# EAGLE design humidifier (EAGLE 8.6.0)
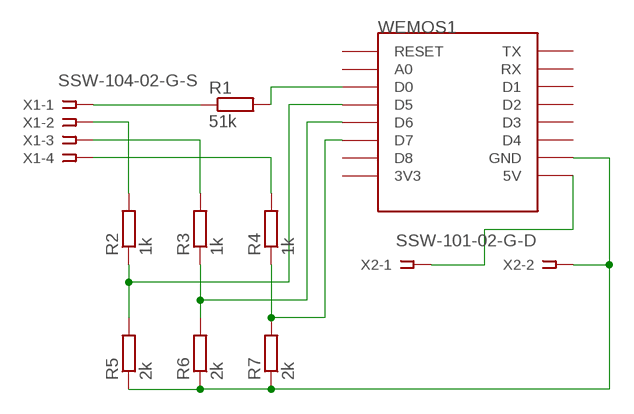
[diagram p0: schematic, sheet 1]

## Parts
R1  51k  R-EU_R1206  [R1206]
R2  1k  R-EU_R1206  [R1206]
R3  1k  R-EU_R1206  [R1206]
R4  1k  R-EU_R1206  [R1206]
R5  2k  R-EU_R1206  [R1206]
R6  2k  R-EU_R1206  [R1206]
R7  2k  R-EU_R1206  [R1206]
WEMOS1  WEMOS-D1-MINI  [WEMOS-D1-MINI]
X1  SSW-104-02-G-S  [SSW-104-02-G-S]
X2  SSW-101-02-G-D  [SSW-101-02-G-D]

## Nets
N$1: R5.1 R6.1 R7.1 WEMOS1.GND X2.2
N$2: WEMOS1.5V X2.1
N$3: R2.2 X1.2
N$4: R3.2 X1.3
N$5: R4.2 X1.4
N$6: R2.1 R5.2 WEMOS1.D5
N$7: R3.1 R6.2 WEMOS1.D6
N$8: R4.1 R7.2 WEMOS1.D7
N$12: R1.1 X1.1
N$13: R1.2 WEMOS1.D0
Unconnected: WEMOS1.3V3 WEMOS1.A0 WEMOS1.D1 WEMOS1.D2 WEMOS1.D3 WEMOS1.D4 WEMOS1.D8 WEMOS1.RESET WEMOS1.RX WEMOS1.TX

## Library data of the parts
R1-R7 = resistor:R-EU_: RESISTOR, European symbol
WEMOS1 = esp8266modules:WEMOS-D1-MINI: WeMos.cc D1 mini ESP8266 module
X1 = con-samtec:SSW-104-02-G-S: THROUGH-HOLE .025" SQ POST SOCKET Source: Samtec SSW.pdf; MF: Samtec Inc.; MPN: SSW-104-02-G-S; OC_FARNELL: unknown; OC_NEWARK: 11P9384
X2 = con-samtec:SSW-101-02-G: THROUGH-HOLE .025" SQ POST SOCKET Source: Samtec SSW.pdf; MF: Samtec Inc.; MPN: SSW-101-02-G-D; OC_FARNELL: unknown; OC_NEWARK: 82P1456

## Board
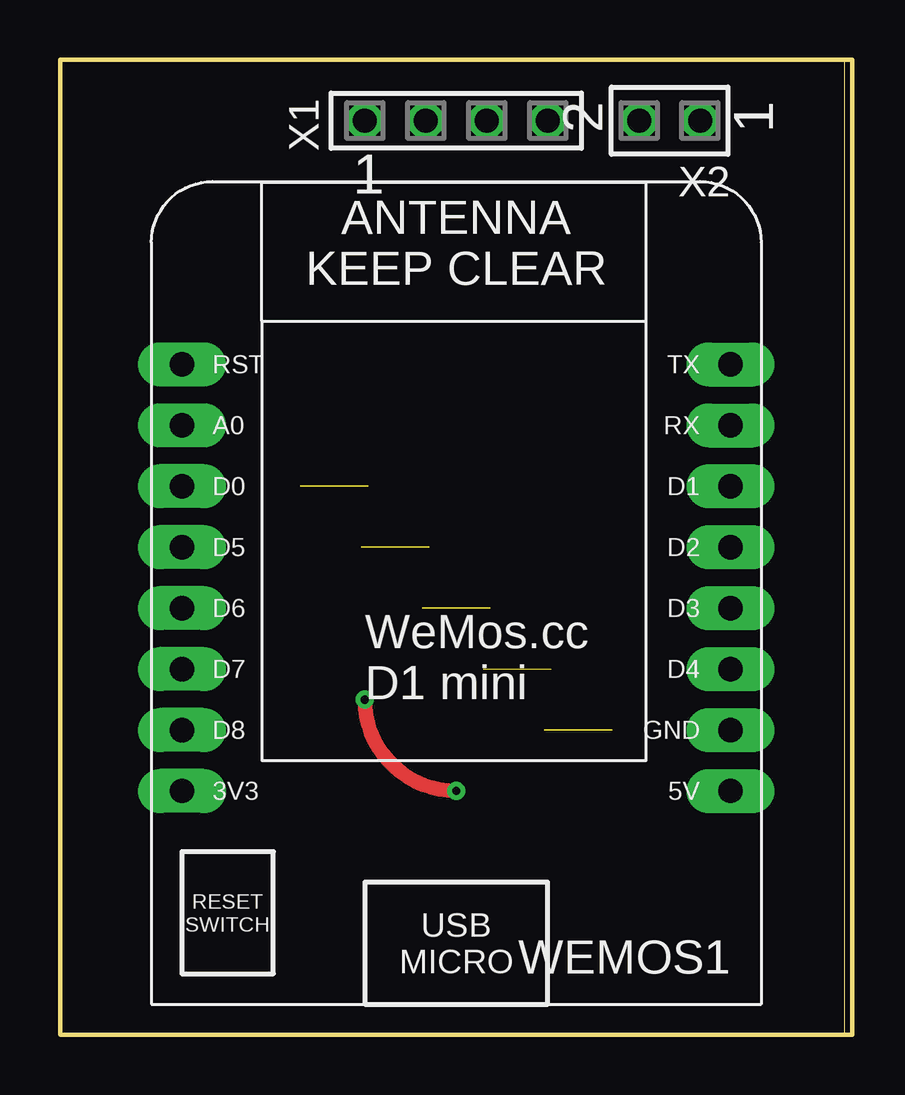
[diagram p1: board, top side]
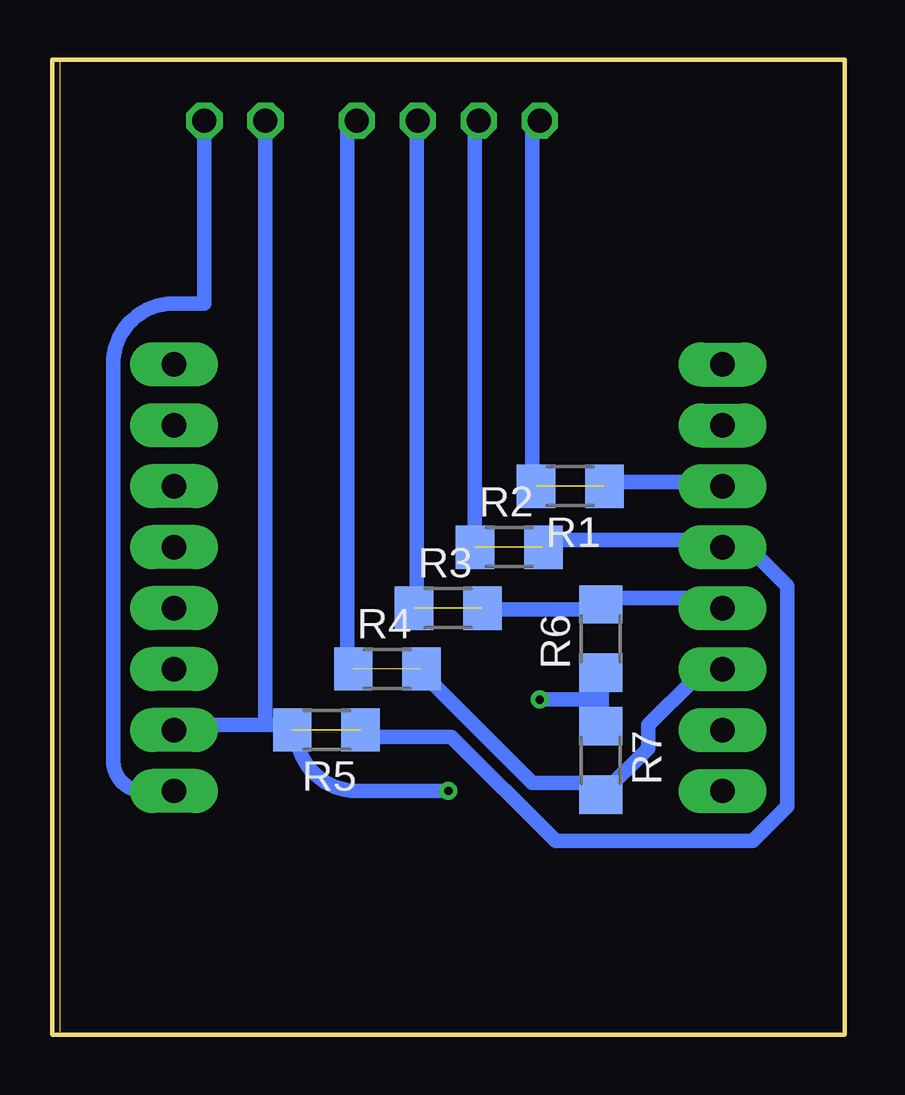
[diagram p2: board, bottom side, seen from below]

Size 32.69 x 40.63 mm. Coordinates in mm from the lower left corner, seen from the top.
Outline: 0,0 32.69,0 32.69,40.63 0,40.63 0,0
Copper layers (1*16): Top 0.035mm / dielectric 1.5mm / Bottom 0.035mm
Design rules "default": minimum track width 24mil, minimum drill 0.8mm, track to track 14mil, track to pad 14mil, pad to pad 14mil, via to via 14mil, smd to smd 6mil, copper to edge 40mil, drill to drill 6mil, minimum pad ring 10mil, minimum via ring 8mil, stop-mask expansion 4mil, vias tented up to drill 0mil, thermal gap 10mil
Milling: 4 lines

### Footprints (pad centres in the part's own frame; a part is rotated, then mirrored left to right if it is on the bottom)
R1206 = smd 1.6 x 1.803: 1 -1.422,0; 2 1.422,0
WEMOS-D1-MINI = drill 1.016 pad 1.829 long: 3V3 -10.16,-10.16; 5V 12.7,-10.16; A0 -10.16,5.08; D0 -10.16,2.54; D1 12.7,2.54; D2 12.7,0; D3 12.7,-2.54; D4 12.7,-5.08; D5 -10.16,0; D6 -10.16,-2.54; D7 -10.16,-5.08; D8 -10.16,-7.62; GND 12.7,-7.62; RESET -10.16,7.62; RX 12.7,5.08; TX 12.7,7.62
SSW-104-02-G-S = drill 1 pad 1.5 octagon: 1 -3.81,0; 2 -1.27,0; 3 1.27,0; 4 3.81,0
SSW-101-02-G-D = drill 1 pad 1.5 octagon: 1 0,-1.27; 2 0,1.27

### Placement (x,y rotation side)
R1  11.43,22.86 180 bottom
R2  13.97,20.32 0 bottom
R3  16.51,17.78 0 bottom
R4  19.05,15.24 0 bottom
R5  21.59,12.7 180 bottom
R6  10.16,16.51 90 bottom
R7  10.16,11.43 270 bottom
WEMOS1  15.24,20.32 0 top
X1  16.51,38.1 0 top
X2  25.4,38.1 90 top

### Tracks (layer width: path | path; a pad name or v marks a point on that pad's centre or on a via)
N$1  (via drill 0.35)  (2 unrouted)
  Top 0.61: v12.7,13.97 arc90 v16.51,10.16
  Bottom 0.61: 10.11,13.97 10.11,14.83 R6.1 | 10.11,13.97 10.11,12.9 R7.1 | 24.13,12.9 27.48,12.9 WEMOS1.GND | 24.13,12.9 23.14,12.9 23.01,12.7 | 10.11,13.97 v12.7,13.97 | v16.51,10.16 20.32,10.16 arc90 22.86,12.7 | X2.2 24.13,12.9
N$2
  Bottom 0.61: WEMOS1.5V 29.21,10.16 arc90 30.48,11.43 30.48,27.94 arc90 27.94,30.48 26.67,30.48 X2.1
N$3  (1 unrouted)
  Bottom 0.61: 15.39,20.32 15.42,20.62 15.42,38 X1.2
N$4  (1 unrouted)
  Bottom 0.61: 17.93,17.78 17.83,18.21 17.83,38 X1.3
N$5  (1 unrouted)
  Bottom 0.61: 20.47,15.24 20.73,15.32 20.73,38 X1.4
N$6  (2 unrouted)
  Bottom 0.61: 20.17,12.7 19.76,12.42 16.38,12.42 12.04,8.08 3.83,8.08 2.39,9.53 2.39,18.69 3.83,20.14 4.8,20.14 WEMOS1.D5 5.28,20.62 12.52,20.62 12.55,20.32
N$7  (1 unrouted)
  Bottom 0.61: 15.09,17.78 14.94,17.73 10.59,17.73 R6.2 10.11,18.21 5.28,18.21 WEMOS1.D6
N$8  (1 unrouted)
  Bottom 0.61: 17.63,15.24 17.35,14.83 13.01,10.49 10.59,10.49 R7.2 10.11,10.01 8.18,11.94 8.18,12.9 6.25,14.83 5.28,14.83 WEMOS1.D7
N$12  (1 unrouted)
  Bottom 0.61: 12.85,22.86 13.01,23.04 13.01,38 X1.1
N$13  (1 unrouted)
  Bottom 0.61: 10.01,22.86 9.63,23.04 5.28,23.04 WEMOS1.D0